# Altium schematic sheet FPGA_MGT.SchDoc: AMC FMC Carrier v4
size A2; CompanyName: WUT; Address1: Warsaw Univeristy of Technology; Address2: Nowowiejska 15/19 00-665 Warsaw; Address3: t.przywozki@gmail.com; DocumentNumber: 1; Revision: 1; SheetNumber: 5; SheetTotal: 29; ModifiedBy: -; CheckedDate: -; Title2: FPGA GTP banks; DivGrp: ISE; Designer: T.Przywozki; Project: AMC FMC Carrier v4
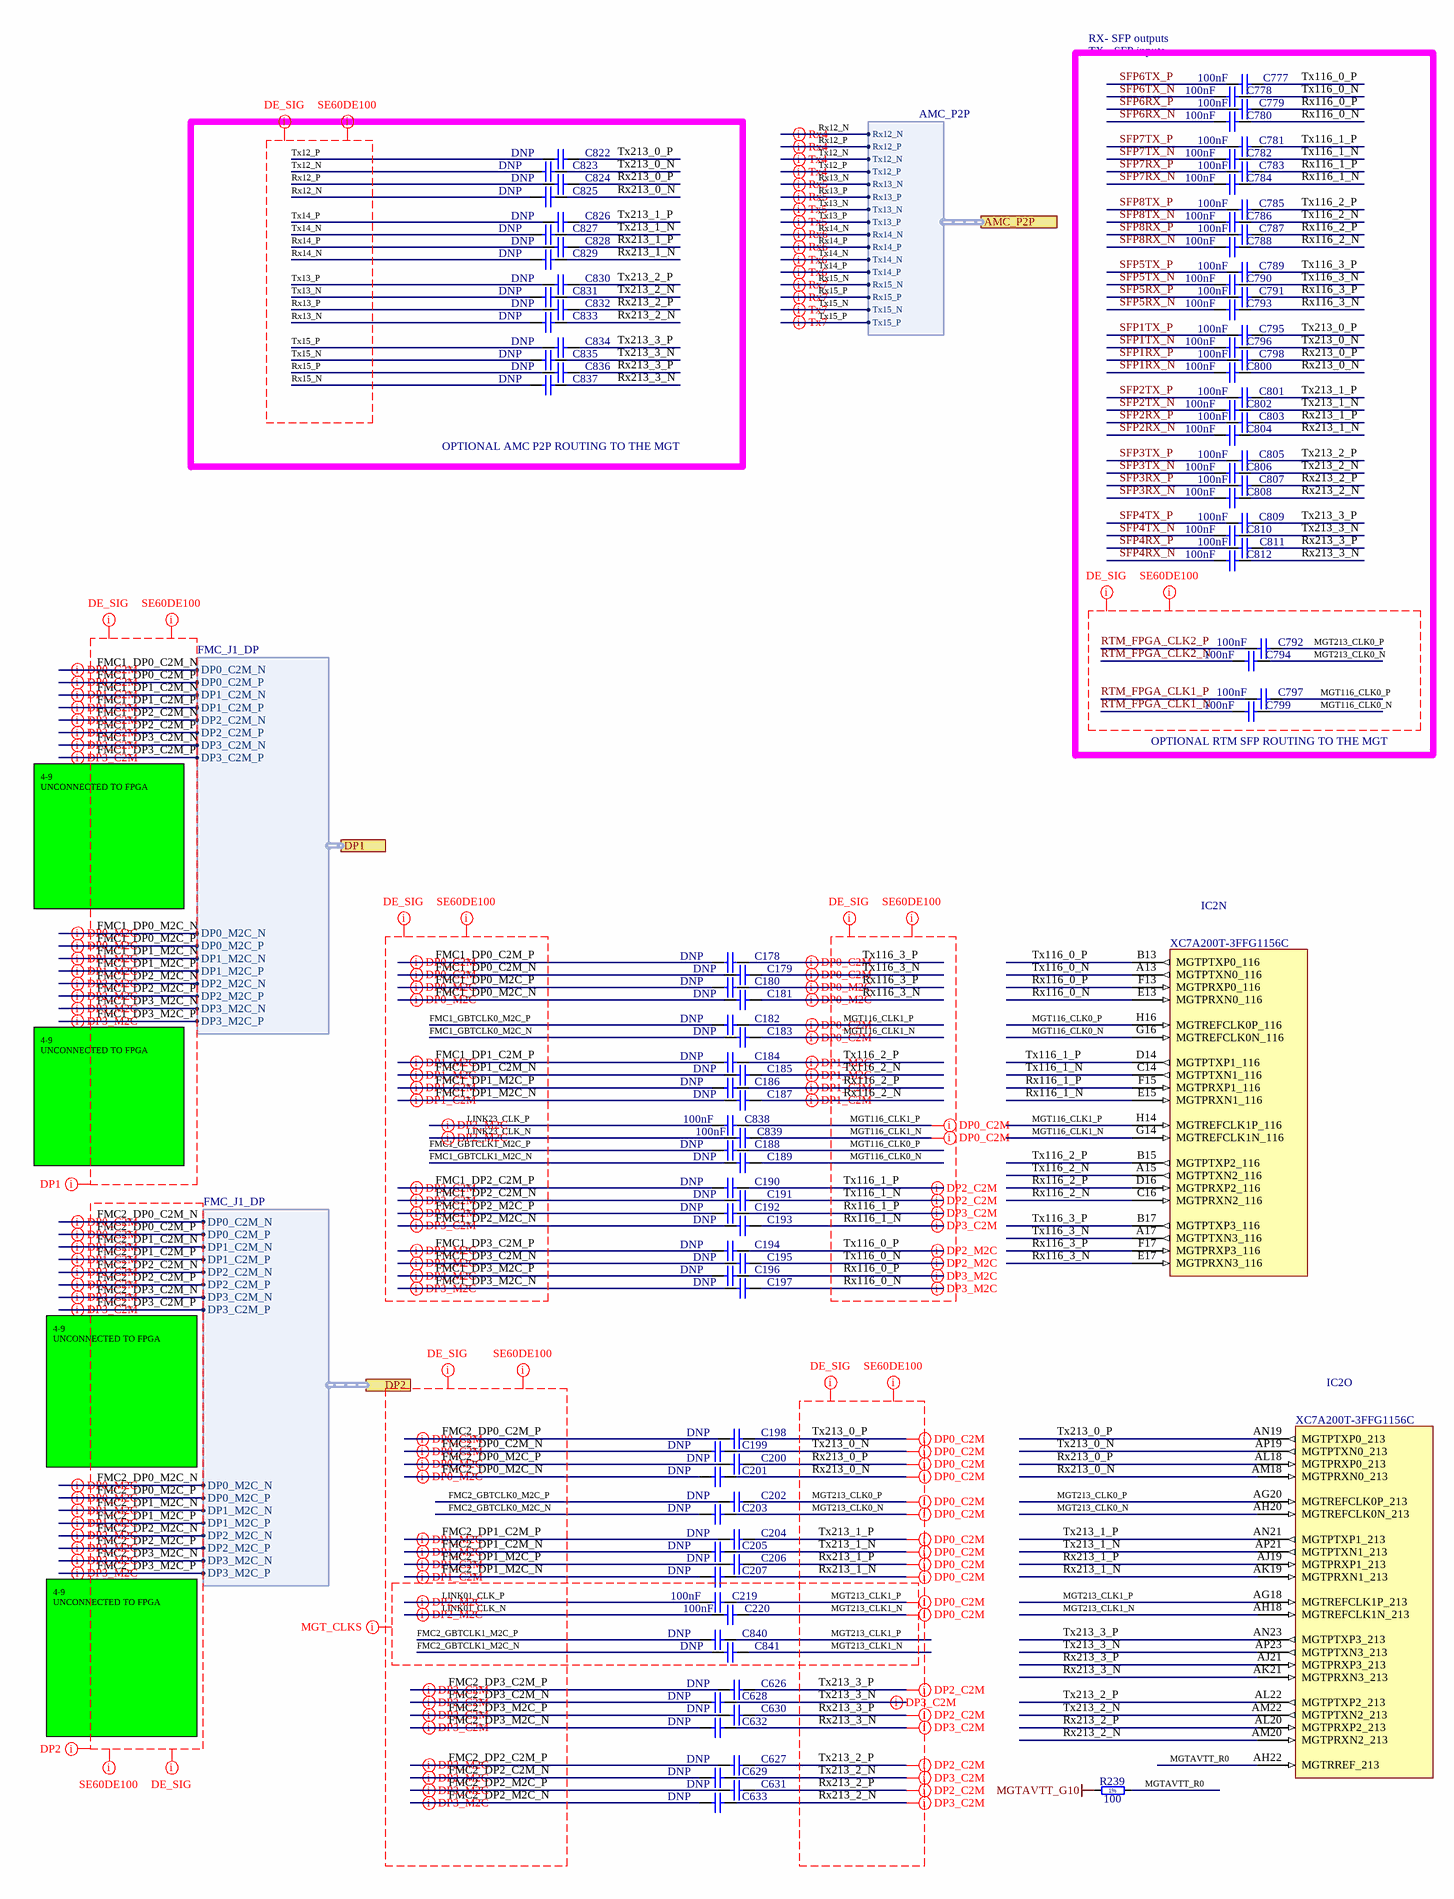
[diagram p0: FPGA_MGT.SchDoc, left]
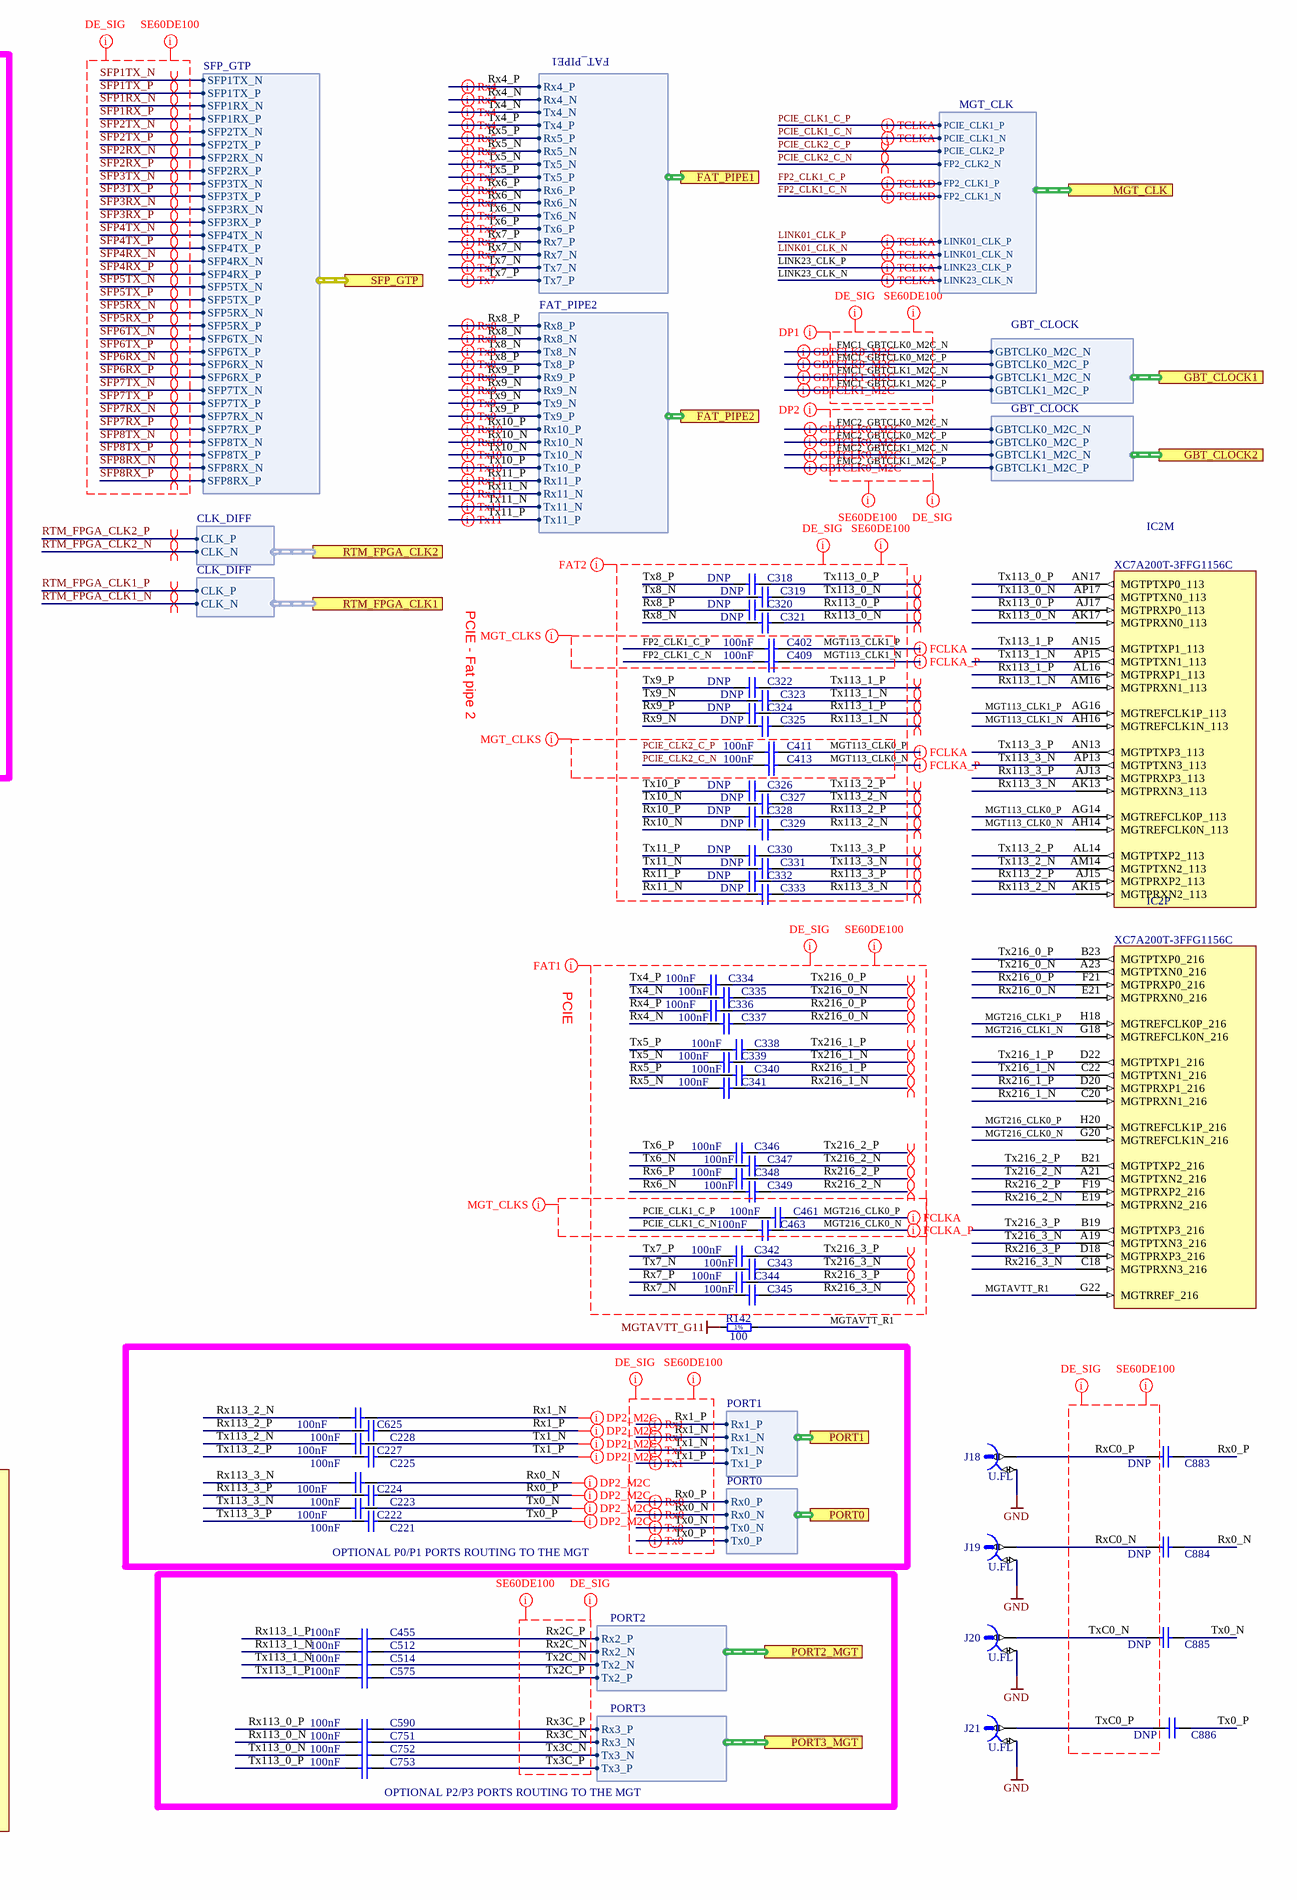
[diagram p1: FPGA_MGT.SchDoc, right]

## Parts
C178  DNP  [CAPC0603X33N]
C179  DNP  [CAPC0603X33N]
C180  DNP  [CAPC0603X33N]
C181  DNP  [CAPC0603X33N]
C182  DNP  [CAPC0603X33N]
C183  DNP  [CAPC0603X33N]
C184  DNP  [CAPC0603X33N]
C185  DNP  [CAPC0603X33N]
C186  DNP  [CAPC0603X33N]
C187  DNP  [CAPC0603X33N]
C188  DNP  [CAPC0603X33N]
C189  DNP  [CAPC0603X33N]
C190  DNP  [CAPC0603X33N]
C191  DNP  [CAPC0603X33N]
C192  DNP  [CAPC0603X33N]
C193  DNP  [CAPC0603X33N]
C194  DNP  [CAPC0603X33N]
C195  DNP  [CAPC0603X33N]
C196  DNP  [CAPC0603X33N]
C197  DNP  [CAPC0603X33N]
C198  DNP  [CAPC0603X33N]
C199  DNP  [CAPC0603X33N]
C200  DNP  [CAPC0603X33N]
C201  DNP  [CAPC0603X33N]
C202  DNP  [CAPC0603X33N]
C203  DNP  [CAPC0603X33N]
C204  DNP  [CAPC0603X33N]
C205  DNP  [CAPC0603X33N]
C206  DNP  [CAPC0603X33N]
C207  DNP  [CAPC0603X33N]
C219  100nF  [CAPC0603X33N]
C220  100nF  [CAPC0603X33N]
C221  100nF  [CAPC0603X33N]
C222  100nF  [CAPC0603X33N]
C223  100nF  [CAPC0603X33N]
C224  100nF  [CAPC0603X33N]
C225  100nF  [CAPC0603X33N]
C227  100nF  [CAPC0603X33N]
C228  100nF  [CAPC0603X33N]
C318  DNP  [CAPC0603X33N]
C319  DNP  [CAPC0603X33N]
C320  DNP  [CAPC0603X33N]
C321  DNP  [CAPC0603X33N]
C322  DNP  [CAPC0603X33N]
C323  DNP  [CAPC0603X33N]
C324  DNP  [CAPC0603X33N]
C325  DNP  [CAPC0603X33N]
C326  DNP  [CAPC0603X33N]
C327  DNP  [CAPC0603X33N]
C328  DNP  [CAPC0603X33N]
C329  DNP  [CAPC0603X33N]
C330  DNP  [CAPC0603X33N]
C331  DNP  [CAPC0603X33N]
C332  DNP  [CAPC0603X33N]
C333  DNP  [CAPC0603X33N]
C334  100nF  [CAPC0603X33N]
C335  100nF  [CAPC0603X33N]
C336  100nF  [CAPC0603X33N]
C337  100nF  [CAPC0603X33N]
C338  100nF  [CAPC0603X33N]
C339  100nF  [CAPC0603X33N]
C340  100nF  [CAPC0603X33N]
C341  100nF  [CAPC0603X33N]
C342  100nF  [CAPC0603X33N]
C343  100nF  [CAPC0603X33N]
C344  100nF  [CAPC0603X33N]
C345  100nF  [CAPC0603X33N]
C346  100nF  [CAPC0603X33N]
C347  100nF  [CAPC0603X33N]
C348  100nF  [CAPC0603X33N]
C349  100nF  [CAPC0603X33N]
C402  100nF  [CAPC0603X33N]
C409  100nF  [CAPC0603X33N]
C411  100nF  [CAPC0603X33N]
C413  100nF  [CAPC0603X33N]
C455  100nF  [CAPC0603X33N]
C461  100nF  [CAPC0603X33N]
C463  100nF  [CAPC0603X33N]
C512  100nF  [CAPC0603X33N]
C514  100nF  [CAPC0603X33N]
C575  100nF  [CAPC0603X33N]
C590  100nF  [CAPC0603X33N]
C625  100nF  [CAPC0603X33N]
C626  DNP  [CAPC0603X33N]
C627  DNP  [CAPC0603X33N]
C628  DNP  [CAPC0603X33N]
C629  DNP  [CAPC0603X33N]
C630  DNP  [CAPC0603X33N]
C631  DNP  [CAPC0603X33N]
C632  DNP  [CAPC0603X33N]
C633  DNP  [CAPC0603X33N]
C751  100nF  [CAPC0603X33N]
C752  100nF  [CAPC0603X33N]
C753  100nF  [CAPC0603X33N]
C777  100nF  [CAPC0603X33N]
C778  100nF  [CAPC0603X33N]
C779  100nF  [CAPC0603X33N]
C780  100nF  [CAPC0603X33N]
C781  100nF  [CAPC0603X33N]
C782  100nF  [CAPC0603X33N]
C783  100nF  [CAPC0603X33N]
C784  100nF  [CAPC0603X33N]
C785  100nF  [CAPC0603X33N]
C786  100nF  [CAPC0603X33N]
C787  100nF  [CAPC0603X33N]
C788  100nF  [CAPC0603X33N]
C789  100nF  [CAPC0603X33N]
C790  100nF  [CAPC0603X33N]
C791  100nF  [CAPC0603X33N]
C792  100nF  [CAPC0603X33N]
C793  100nF  [CAPC0603X33N]
C794  100nF  [CAPC0603X33N]
C795  100nF  [CAPC0603X33N]
C796  100nF  [CAPC0603X33N]
C797  100nF  [CAPC0603X33N]
C798  100nF  [CAPC0603X33N]
C799  100nF  [CAPC0603X33N]
C800  100nF  [CAPC0603X33N]
C801  100nF  [CAPC0603X33N]
C802  100nF  [CAPC0603X33N]
C803  100nF  [CAPC0603X33N]
C804  100nF  [CAPC0603X33N]
C805  100nF  [CAPC0603X33N]
C806  100nF  [CAPC0603X33N]
C807  100nF  [CAPC0603X33N]
C808  100nF  [CAPC0603X33N]
C809  100nF  [CAPC0603X33N]
C810  100nF  [CAPC0603X33N]
C811  100nF  [CAPC0603X33N]
C812  100nF  [CAPC0603X33N]
C822  DNP  [CAPC0603X33N]
C823  DNP  [CAPC0603X33N]
C824  DNP  [CAPC0603X33N]
C825  DNP  [CAPC0603X33N]
C826  DNP  [CAPC0603X33N]
C827  DNP  [CAPC0603X33N]
C828  DNP  [CAPC0603X33N]
C829  DNP  [CAPC0603X33N]
C830  DNP  [CAPC0603X33N]
C831  DNP  [CAPC0603X33N]
C832  DNP  [CAPC0603X33N]
C833  DNP  [CAPC0603X33N]
C834  DNP  [CAPC0603X33N]
C835  DNP  [CAPC0603X33N]
C836  DNP  [CAPC0603X33N]
C837  DNP  [CAPC0603X33N]
C838  100nF  [CAPC0603X33N]
C839  100nF  [CAPC0603X33N]
C840  DNP  [CAPC0603X33N]
C841  DNP  [CAPC0603X33N]
C883  DNP  [CAPC0603X33N]
C884  DNP  [CAPC0603X33N]
C885  DNP  [CAPC0603X33N]
C886  DNP  [CAPC0603X33N]
IC2  XC7A200T-3FFG1156C  [BGA1156C100P34X34_3500X3500X335]  (parts M,N,O,P of 23)
J18  U.FL  [HIROSE_U.FL-R-SMT-1(10)]
J19  U.FL  [HIROSE_U.FL-R-SMT-1(10)]
J20  U.FL  [HIROSE_U.FL-R-SMT-1(10)]
J21  U.FL  [HIROSE_U.FL-R-SMT-1(10)]
R142  100  [RESC1005X40N]
R239  100  [RESC1005X40N]

## Blocks framed on the sheet
OPTIONAL AMC P2P ROUTING TO THE MGT: C822-C837
OPTIONAL P0/P1 PORTS ROUTING TO THE MGT: C221-C225 C227 C228 C625

## Ports
AMC_P2P (harness AMC_P2P), DP1 (harness FMC_J1_DP), DP2 (harness FMC_J1_DP), FAT_PIPE1 (harness FAT_PIPE1), FAT_PIPE2 (harness FAT_PIPE2), GBT_CLOCK1 (harness GBT_CLOCK), GBT_CLOCK2 (harness GBT_CLOCK), MGT_CLK (harness MGT_CLK), PORT0 (harness PORT0), PORT1 (harness PORT1), PORT2_MGT (harness PORT2), PORT3_MGT (harness PORT3), RTM_FPGA_CLK1 (harness CLK_DIFF), RTM_FPGA_CLK2 (harness CLK_DIFF), SFP_GTP (harness SFP_GTP)

## Harnesses
PORT0: Rx0_P, Rx0_N, Tx0_N, Tx0_P
PORT1: Rx1_P, Rx1_N, Tx1_N, Tx1_P
FAT_PIPE1: Rx4_P, Rx4_N, Tx4_N, Tx4_P, Rx5_P, Rx5_N, Tx5_N, Tx5_P, Rx6_P, Rx6_N, Tx6_N, Tx6_P, Rx7_P, Rx7_N, Tx7_N, Tx7_P
FAT_PIPE2: Rx8_P, Rx8_N, Tx8_N, Tx8_P, Rx9_P, Rx9_N, Tx9_N, Tx9_P, Rx10_P, Rx10_N, Tx10_N, Tx10_P, Rx11_P, Rx11_N, Tx11_N, Tx11_P
GBT_CLOCK: GBTCLK0_M2C_N, GBTCLK0_M2C_P, GBTCLK1_M2C_N, GBTCLK1_M2C_P
FMC_J1_DP: DP1_C2M_N, DP1_C2M_P, DP1_M2C_N, DP1_M2C_P, DP2_C2M_N, DP2_C2M_P, DP2_M2C_N, DP2_M2C_P, DP3_C2M_N, DP3_C2M_P, DP3_M2C_N, DP3_M2C_P, DP0_C2M_N, DP0_C2M_P, DP0_M2C_N, DP0_M2C_P
PORT3: Rx3_P, Rx3_N, Tx3_N, Tx3_P
PORT2: Rx2_P, Rx2_N, Tx2_N, Tx2_P
SFP_GTP: SFP1RX_N, SFP1RX_P, SFP1TX_N, SFP1TX_P, SFP2TX_N, SFP2TX_P, SFP2RX_N, SFP2RX_P, SFP3TX_N, SFP3TX_P, SFP3RX_N, SFP3RX_P, SFP4TX_N, SFP4TX_P, SFP4RX_N, SFP4RX_P, SFP5TX_N, SFP5TX_P, SFP5RX_N, SFP5RX_P, SFP6TX_N, SFP6TX_P, SFP6RX_N, SFP6RX_P, SFP7TX_N, SFP7TX_P, SFP7RX_N, SFP7RX_P, SFP8TX_N, SFP8TX_P, SFP8RX_N, SFP8RX_P
CLK_DIFF: CLK_P, CLK_N
AMC_P2P: Rx12_N, Rx12_P, Tx12_N, Tx12_P, Rx13_N, Rx13_P, Tx13_N, Tx13_P, Rx14_N, Rx14_P, Tx14_N, Tx14_P, Rx15_N, Rx15_P, Tx15_N, Tx15_P
MGT_CLK: PCIE_CLK1_P, PCIE_CLK1_N, FP2_CLK1_P, FP2_CLK1_N, PCIE_CLK2_P, FP2_CLK2_N, LINK01_CLK_P, LINK01_CLK_N, LINK23_CLK_P, LINK23_CLK_N

## Nets
GND: J18.2 J19.2 J20.2 J21.2
MGTAVTT_G10: R239.1
MGTAVTT_G11: R142.1
FMC1_DP0_C2M_N: C179.1 ; port DP1.DP0_C2M_N
FMC1_DP0_C2M_P: C178.1 ; port DP1.DP0_C2M_P
FMC1_DP0_M2C_N: C181.1 ; port DP1.DP0_M2C_N
FMC1_DP0_M2C_P: C180.1 ; port DP1.DP0_M2C_P
FMC1_DP1_C2M_N: C185.1 ; port DP1.DP1_C2M_N
FMC1_DP1_C2M_P: C184.1 ; port DP1.DP1_C2M_P
FMC1_DP1_M2C_N: C187.1 ; port DP1.DP1_M2C_N
FMC1_DP1_M2C_P: C186.1 ; port DP1.DP1_M2C_P
FMC1_DP2_C2M_N: C191.1 ; port DP1.DP2_C2M_N
FMC1_DP2_C2M_P: C190.1 ; port DP1.DP2_C2M_P
FMC1_DP2_M2C_N: C193.1 ; port DP1.DP2_M2C_N
FMC1_DP2_M2C_P: C192.1 ; port DP1.DP2_M2C_P
FMC1_DP3_C2M_N: C195.1 ; port DP1.DP3_C2M_N
FMC1_DP3_C2M_P: C194.1 ; port DP1.DP3_C2M_P
FMC1_DP3_M2C_N: C197.1 ; port DP1.DP3_M2C_N
FMC1_DP3_M2C_P: C196.1 ; port DP1.DP3_M2C_P
FMC1_GBTCLK0_M2C_N: C183.1 ; port GBT_CLOCK1.GBTCLK0_M2C_N
FMC1_GBTCLK0_M2C_P: C182.1 ; port GBT_CLOCK1.GBTCLK0_M2C_P
FMC1_GBTCLK1_M2C_N: C189.1 ; port GBT_CLOCK1.GBTCLK1_M2C_N
FMC1_GBTCLK1_M2C_P: C188.1 ; port GBT_CLOCK1.GBTCLK1_M2C_P
FMC2_DP0_C2M_N: C199.1 ; port DP2.DP0_C2M_N
FMC2_DP0_C2M_P: C198.1 ; port DP2.DP0_C2M_P
FMC2_DP0_M2C_N: C201.1 ; port DP2.DP0_M2C_N
FMC2_DP0_M2C_P: C200.1 ; port DP2.DP0_M2C_P
FMC2_DP1_C2M_N: C205.1 ; port DP2.DP1_C2M_N
FMC2_DP1_C2M_P: C204.1 ; port DP2.DP1_C2M_P
FMC2_DP1_M2C_N: C207.1 ; port DP2.DP1_M2C_N
FMC2_DP1_M2C_P: C206.1 ; port DP2.DP1_M2C_P
FMC2_DP2_C2M_N: C629.1 ; port DP2.DP2_C2M_N
FMC2_DP2_C2M_P: C627.1 ; port DP2.DP2_C2M_P
FMC2_DP2_M2C_N: C633.1 ; port DP2.DP2_M2C_N
FMC2_DP2_M2C_P: C631.1 ; port DP2.DP2_M2C_P
FMC2_DP3_C2M_N: C628.1 ; port DP2.DP3_C2M_N
FMC2_DP3_C2M_P: C626.1 ; port DP2.DP3_C2M_P
FMC2_DP3_M2C_N: C632.1 ; port DP2.DP3_M2C_N
FMC2_DP3_M2C_P: C630.1 ; port DP2.DP3_M2C_P
FMC2_GBTCLK0_M2C_N: C203.1 ; port GBT_CLOCK2.GBTCLK0_M2C_N
FMC2_GBTCLK0_M2C_P: C202.1 ; port GBT_CLOCK2.GBTCLK0_M2C_P
FMC2_GBTCLK1_M2C_N: C841.1 ; port GBT_CLOCK2.GBTCLK1_M2C_N
FMC2_GBTCLK1_M2C_P: C840.1 ; port GBT_CLOCK2.GBTCLK1_M2C_P
FP2_CLK1_C_N: C409.1 ; port MGT_CLK.FP2_CLK1_N
FP2_CLK1_C_P: C402.1 ; port MGT_CLK.FP2_CLK1_P
LINK01_CLK_N: C220.1 ; port MGT_CLK.LINK01_CLK_N
LINK01_CLK_P: C219.1 ; port MGT_CLK.LINK01_CLK_P
LINK23_CLK_N: C839.1 ; port MGT_CLK.LINK23_CLK_N
LINK23_CLK_P: C838.1 ; port MGT_CLK.LINK23_CLK_P
MGT113_CLK0_N: C413.2 IC2.AH14(MGTREFCLK0N_113)
MGT113_CLK0_P: C411.2 IC2.AG14(MGTREFCLK0P_113)
MGT113_CLK1_N: C409.2 IC2.AH16(MGTREFCLK1N_113)
MGT113_CLK1_P: C402.2 IC2.AG16(MGTREFCLK1P_113)
MGT116_CLK0_N: C189.2 C799.2 IC2.G16(MGTREFCLK0N_116)
MGT116_CLK0_P: C188.2 C797.2 IC2.H16(MGTREFCLK0P_116)
MGT116_CLK1_N: C183.2 C839.2 IC2.G14(MGTREFCLK1N_116)
MGT116_CLK1_P: C182.2 C838.2 IC2.H14(MGTREFCLK1P_116)
MGT213_CLK0_N: C203.2 C794.2 IC2.AH20(MGTREFCLK0N_213)
MGT213_CLK0_P: C202.2 C792.2 IC2.AG20(MGTREFCLK0P_213)
MGT213_CLK1_N: C220.2 C841.2 IC2.AH18(MGTREFCLK1N_213)
MGT213_CLK1_P: C219.2 C840.2 IC2.AG18(MGTREFCLK1P_213)
MGT216_CLK0_N: C463.2 IC2.G20(MGTREFCLK1N_216)
MGT216_CLK0_P: C461.2 IC2.H20(MGTREFCLK1P_216)
MGT216_CLK1_N: IC2.G18(MGTREFCLK0N_216)
MGT216_CLK1_P: IC2.H18(MGTREFCLK0P_216)
MGTAVTT_R0: IC2.AH22(MGTRREF_213) R239.2
MGTAVTT_R1: IC2.G22(MGTRREF_216) R142.2
PCIE_CLK1_C_N: C463.1 ; port MGT_CLK.PCIE_CLK1_N
PCIE_CLK1_C_P: C461.1 ; port MGT_CLK.PCIE_CLK1_P
PCIE_CLK2_C_N: C413.1 ; port MGT_CLK.FP2_CLK2_N
PCIE_CLK2_C_P: C411.1 ; port MGT_CLK.PCIE_CLK2_P
RTM_FPGA_CLK1_N: C799.1 ; port RTM_FPGA_CLK1.CLK_N
RTM_FPGA_CLK1_P: C797.1 ; port RTM_FPGA_CLK1.CLK_P
RTM_FPGA_CLK2_N: C794.1 ; port RTM_FPGA_CLK2.CLK_N
RTM_FPGA_CLK2_P: C792.1 ; port RTM_FPGA_CLK2.CLK_P
Rx0_N: C224.1 C884.1 ; port PORT0.Rx0_N
Rx0_P: C223.1 C883.1 ; port PORT0.Rx0_P
Rx1_N: C625.1 ; port PORT1.Rx1_N
Rx1_P: C228.1 ; port PORT1.Rx1_P
Rx2C_N: C512.2 ; port PORT2_MGT.Rx2_N
Rx2C_P: C455.2 ; port PORT2_MGT.Rx2_P
Rx3C_N: C751.2 ; port PORT3_MGT.Rx3_N
Rx3C_P: C590.2 ; port PORT3_MGT.Rx3_P
Rx4_N: C337.1 ; port FAT_PIPE1.Rx4_N
Rx4_P: C336.1 ; port FAT_PIPE1.Rx4_P
Rx5_N: C341.1 ; port FAT_PIPE1.Rx5_N
Rx5_P: C340.1 ; port FAT_PIPE1.Rx5_P
Rx6_N: C349.1 ; port FAT_PIPE1.Rx6_N
Rx6_P: C348.1 ; port FAT_PIPE1.Rx6_P
Rx7_N: C345.1 ; port FAT_PIPE1.Rx7_N
Rx7_P: C344.1 ; port FAT_PIPE1.Rx7_P
Rx8_N: C321.1 ; port FAT_PIPE2.Rx8_N
Rx8_P: C320.1 ; port FAT_PIPE2.Rx8_P
Rx9_N: C325.1 ; port FAT_PIPE2.Rx9_N
Rx9_P: C324.1 ; port FAT_PIPE2.Rx9_P
Rx10_N: C329.1 ; port FAT_PIPE2.Rx10_N
Rx10_P: C328.1 ; port FAT_PIPE2.Rx10_P
Rx11_N: C333.1 ; port FAT_PIPE2.Rx11_N
Rx11_P: C332.1 ; port FAT_PIPE2.Rx11_P
Rx12_N: C825.1 ; port AMC_P2P.Rx12_N
Rx12_P: C824.1 ; port AMC_P2P.Rx12_P
Rx13_N: C833.1 ; port AMC_P2P.Rx13_N
Rx13_P: C832.1 ; port AMC_P2P.Rx13_P
Rx14_N: C829.1 ; port AMC_P2P.Rx14_N
Rx14_P: C828.1 ; port AMC_P2P.Rx14_P
Rx15_N: C837.1 ; port AMC_P2P.Rx15_N
Rx15_P: C836.1 ; port AMC_P2P.Rx15_P
Rx113_0_N: C321.2 C751.1 IC2.AK17(MGTPRXN0_113)
Rx113_0_P: C320.2 C590.1 IC2.AJ17(MGTPRXP0_113)
Rx113_1_N: C325.2 C512.1 IC2.AM16(MGTPRXN1_113)
Rx113_1_P: C324.2 C455.1 IC2.AL16(MGTPRXP1_113)
Rx113_2_N: C329.2 C625.2 IC2.AK15(MGTPRXN2_113)
Rx113_2_P: C228.2 C328.2 IC2.AJ15(MGTPRXP2_113)
Rx113_3_N: C224.2 C333.2 IC2.AK13(MGTPRXN3_113)
Rx113_3_P: C223.2 C332.2 IC2.AJ13(MGTPRXP3_113)
Rx116_0_N: C197.2 C780.2 IC2.E13(MGTPRXN0_116)
Rx116_0_P: C196.2 C779.2 IC2.F13(MGTPRXP0_116)
Rx116_1_N: C193.2 C784.2 IC2.E15(MGTPRXN1_116)
Rx116_1_P: C192.2 C783.2 IC2.F15(MGTPRXP1_116)
Rx116_2_N: C187.2 C788.2 IC2.C16(MGTPRXN2_116)
Rx116_2_P: C186.2 C787.2 IC2.D16(MGTPRXP2_116)
Rx116_3_N: C181.2 C793.2 IC2.E17(MGTPRXN3_116)
Rx116_3_P: C180.2 C791.2 IC2.F17(MGTPRXP3_116)
Rx213_0_N: C201.2 C800.2 C825.2 IC2.AM18(MGTPRXN0_213)
Rx213_0_P: C200.2 C798.2 C824.2 IC2.AL18(MGTPRXP0_213)
Rx213_1_N: C207.2 C804.2 C829.2 IC2.AK19(MGTPRXN1_213)
Rx213_1_P: C206.2 C803.2 C828.2 IC2.AJ19(MGTPRXP1_213)
Rx213_2_N: C633.2 C808.2 C833.2 IC2.AM20(MGTPRXN2_213)
Rx213_2_P: C631.2 C807.2 C832.2 IC2.AL20(MGTPRXP2_213)
Rx213_3_N: C632.2 C812.2 C837.2 IC2.AK21(MGTPRXN3_213)
Rx213_3_P: C630.2 C811.2 C836.2 IC2.AJ21(MGTPRXP3_213)
Rx216_0_N: C337.2 IC2.E21(MGTPRXN0_216)
Rx216_0_P: C336.2 IC2.F21(MGTPRXP0_216)
Rx216_1_N: C341.2 IC2.C20(MGTPRXN1_216)
Rx216_1_P: C340.2 IC2.D20(MGTPRXP1_216)
Rx216_2_N: C349.2 IC2.E19(MGTPRXN2_216)
Rx216_2_P: C348.2 IC2.F19(MGTPRXP2_216)
Rx216_3_N: C345.2 IC2.C18(MGTPRXN3_216)
Rx216_3_P: C344.2 IC2.D18(MGTPRXP3_216)
RxC0_N: C884.2 J19.1
RxC0_P: C883.2 J18.1
SFP1RX_N: C800.1 ; port SFP_GTP.SFP1RX_N
SFP1RX_P: C798.1 ; port SFP_GTP.SFP1RX_P
SFP1TX_N: C796.1 ; port SFP_GTP.SFP1TX_N
SFP1TX_P: C795.1 ; port SFP_GTP.SFP1TX_P
SFP2RX_N: C804.1 ; port SFP_GTP.SFP2RX_N
SFP2RX_P: C803.1 ; port SFP_GTP.SFP2RX_P
SFP2TX_N: C802.1 ; port SFP_GTP.SFP2TX_N
SFP2TX_P: C801.1 ; port SFP_GTP.SFP2TX_P
SFP3RX_N: C808.1 ; port SFP_GTP.SFP3RX_N
SFP3RX_P: C807.1 ; port SFP_GTP.SFP3RX_P
SFP3TX_N: C806.1 ; port SFP_GTP.SFP3TX_N
SFP3TX_P: C805.1 ; port SFP_GTP.SFP3TX_P
SFP4RX_N: C812.1 ; port SFP_GTP.SFP4RX_N
SFP4RX_P: C811.1 ; port SFP_GTP.SFP4RX_P
SFP4TX_N: C810.1 ; port SFP_GTP.SFP4TX_N
SFP4TX_P: C809.1 ; port SFP_GTP.SFP4TX_P
SFP5RX_N: C793.1 ; port SFP_GTP.SFP5RX_N
SFP5RX_P: C791.1 ; port SFP_GTP.SFP5RX_P
SFP5TX_N: C790.1 ; port SFP_GTP.SFP5TX_N
SFP5TX_P: C789.1 ; port SFP_GTP.SFP5TX_P
SFP6RX_N: C780.1 ; port SFP_GTP.SFP6RX_N
SFP6RX_P: C779.1 ; port SFP_GTP.SFP6RX_P
SFP6TX_N: C778.1 ; port SFP_GTP.SFP6TX_N
SFP6TX_P: C777.1 ; port SFP_GTP.SFP6TX_P
SFP7RX_N: C784.1 ; port SFP_GTP.SFP7RX_N
SFP7RX_P: C783.1 ; port SFP_GTP.SFP7RX_P
SFP7TX_N: C782.1 ; port SFP_GTP.SFP7TX_N
SFP7TX_P: C781.1 ; port SFP_GTP.SFP7TX_P
SFP8RX_N: C788.1 ; port SFP_GTP.SFP8RX_N
SFP8RX_P: C787.1 ; port SFP_GTP.SFP8RX_P
SFP8TX_N: C786.1 ; port SFP_GTP.SFP8TX_N
SFP8TX_P: C785.1 ; port SFP_GTP.SFP8TX_P
Tx0_N: C222.1 C885.1 ; port PORT0.Tx0_N
Tx0_P: C221.1 C886.1 ; port PORT0.Tx0_P
Tx1_N: C227.1 ; port PORT1.Tx1_N
Tx1_P: C225.1 ; port PORT1.Tx1_P
Tx2C_N: C514.2 ; port PORT2_MGT.Tx2_N
Tx2C_P: C575.2 ; port PORT2_MGT.Tx2_P
Tx3C_N: C752.2 ; port PORT3_MGT.Tx3_N
Tx3C_P: C753.2 ; port PORT3_MGT.Tx3_P
Tx4_N: C335.1 ; port FAT_PIPE1.Tx4_N
Tx4_P: C334.1 ; port FAT_PIPE1.Tx4_P
Tx5_N: C339.1 ; port FAT_PIPE1.Tx5_N
Tx5_P: C338.1 ; port FAT_PIPE1.Tx5_P
Tx6_N: C347.1 ; port FAT_PIPE1.Tx6_N
Tx6_P: C346.1 ; port FAT_PIPE1.Tx6_P
Tx7_N: C343.1 ; port FAT_PIPE1.Tx7_N
Tx7_P: C342.1 ; port FAT_PIPE1.Tx7_P
Tx8_N: C319.1 ; port FAT_PIPE2.Tx8_N
Tx8_P: C318.1 ; port FAT_PIPE2.Tx8_P
Tx9_N: C323.1 ; port FAT_PIPE2.Tx9_N
Tx9_P: C322.1 ; port FAT_PIPE2.Tx9_P
Tx10_N: C327.1 ; port FAT_PIPE2.Tx10_N
Tx10_P: C326.1 ; port FAT_PIPE2.Tx10_P
Tx11_N: C331.1 ; port FAT_PIPE2.Tx11_N
Tx11_P: C330.1 ; port FAT_PIPE2.Tx11_P
Tx12_N: C823.1 ; port AMC_P2P.Tx12_N
Tx12_P: C822.1 ; port AMC_P2P.Tx12_P
Tx13_N: C831.1 ; port AMC_P2P.Tx13_N
Tx13_P: C830.1 ; port AMC_P2P.Tx13_P
Tx14_N: C827.1 ; port AMC_P2P.Tx14_N
Tx14_P: C826.1 ; port AMC_P2P.Tx14_P
Tx15_N: C835.1 ; port AMC_P2P.Tx15_N
Tx15_P: C834.1 ; port AMC_P2P.Tx15_P
Tx113_0_N: C319.2 C752.1 IC2.AP17(MGTPTXN0_113)
Tx113_0_P: C318.2 C753.1 IC2.AN17(MGTPTXP0_113)
Tx113_1_N: C323.2 C514.1 IC2.AP15(MGTPTXN1_113)
Tx113_1_P: C322.2 C575.1 IC2.AN15(MGTPTXP1_113)
Tx113_2_N: C227.2 C327.2 IC2.AM14(MGTPTXN2_113)
Tx113_2_P: C225.2 C326.2 IC2.AL14(MGTPTXP2_113)
Tx113_3_N: C222.2 C331.2 IC2.AP13(MGTPTXN3_113)
Tx113_3_P: C221.2 C330.2 IC2.AN13(MGTPTXP3_113)
Tx116_0_N: C195.2 C778.2 IC2.A13(MGTPTXN0_116)
Tx116_0_P: C194.2 C777.2 IC2.B13(MGTPTXP0_116)
Tx116_1_N: C191.2 C782.2 IC2.C14(MGTPTXN1_116)
Tx116_1_P: C190.2 C781.2 IC2.D14(MGTPTXP1_116)
Tx116_2_N: C185.2 C786.2 IC2.A15(MGTPTXN2_116)
Tx116_2_P: C184.2 C785.2 IC2.B15(MGTPTXP2_116)
Tx116_3_N: C179.2 C790.2 IC2.A17(MGTPTXN3_116)
Tx116_3_P: C178.2 C789.2 IC2.B17(MGTPTXP3_116)
Tx213_0_N: C199.2 C796.2 C823.2 IC2.AP19(MGTPTXN0_213)
Tx213_0_P: C198.2 C795.2 C822.2 IC2.AN19(MGTPTXP0_213)
Tx213_1_N: C205.2 C802.2 C827.2 IC2.AP21(MGTPTXN1_213)
Tx213_1_P: C204.2 C801.2 C826.2 IC2.AN21(MGTPTXP1_213)
Tx213_2_N: C629.2 C806.2 C831.2 IC2.AM22(MGTPTXN2_213)
Tx213_2_P: C627.2 C805.2 C830.2 IC2.AL22(MGTPTXP2_213)
Tx213_3_N: C628.2 C810.2 C835.2 IC2.AP23(MGTPTXN3_213)
Tx213_3_P: C626.2 C809.2 C834.2 IC2.AN23(MGTPTXP3_213)
Tx216_0_N: C335.2 IC2.A23(MGTPTXN0_216)
Tx216_0_P: C334.2 IC2.B23(MGTPTXP0_216)
Tx216_1_N: C339.2 IC2.C22(MGTPTXN1_216)
Tx216_1_P: C338.2 IC2.D22(MGTPTXP1_216)
Tx216_2_N: C347.2 IC2.A21(MGTPTXN2_216)
Tx216_2_P: C346.2 IC2.B21(MGTPTXP2_216)
Tx216_3_N: C343.2 IC2.A19(MGTPTXN3_216)
Tx216_3_P: C342.2 IC2.B19(MGTPTXP3_216)
TxC0_N: C885.2 J20.1
TxC0_P: C886.2 J21.1

## Layout directives
differential pair: FMC1_DP0_C2M_N, FMC1_DP0_C2M_P, FMC1_DP0_M2C_N, FMC1_DP0_M2C_P, FMC1_DP1_C2M_N, FMC1_DP1_C2M_P, FMC1_DP1_M2C_N, FMC1_DP1_M2C_P, FMC1_DP2_C2M_N, FMC1_DP2_C2M_P, FMC1_DP2_M2C_N, FMC1_DP2_M2C_P, FMC1_DP3_C2M_N, FMC1_DP3_C2M_P, FMC1_DP3_M2C_N, FMC1_DP3_M2C_P, FMC1_GBTCLK0_M2C_N, FMC1_GBTCLK0_M2C_P, FMC1_GBTCLK1_M2C_N, FMC1_GBTCLK1_M2C_P, FMC2_DP0_C2M_N, FMC2_DP0_C2M_P, FMC2_DP0_M2C_N, FMC2_DP0_M2C_P, FMC2_DP1_C2M_N, FMC2_DP1_C2M_P, FMC2_DP1_M2C_N, FMC2_DP1_M2C_P, FMC2_DP2_C2M_N, FMC2_DP2_C2M_P, FMC2_DP2_M2C_N, FMC2_DP2_M2C_P, FMC2_DP3_C2M_N, FMC2_DP3_C2M_P, FMC2_DP3_M2C_N, FMC2_DP3_M2C_P, FMC2_GBTCLK0_M2C_N, FMC2_GBTCLK0_M2C_P, FMC2_GBTCLK1_M2C_N, FMC2_GBTCLK1_M2C_P, FP2_CLK1_C_N, FP2_CLK1_C_P, LINK01_CLK_N, LINK01_CLK_P, LINK23_CLK_N, LINK23_CLK_P, MGT113_CLK0_N, MGT113_CLK0_P, MGT113_CLK1_N, MGT113_CLK1_P, MGT116_CLK1_N, MGT116_CLK1_P, MGT213_CLK0_N, MGT213_CLK0_P, MGT213_CLK1_N, MGT213_CLK1_P, MGT216_CLK0_N, MGT216_CLK0_P, PCIE_CLK1_C_N, PCIE_CLK1_C_P, PCIE_CLK2_C_N, PCIE_CLK2_C_P, RTM_FPGA_CLK1_N, RTM_FPGA_CLK1_P, RTM_FPGA_CLK2_N, RTM_FPGA_CLK2_P, Rx0_N, Rx0_P, Rx1_N, Rx1_P, Rx4_N, Rx4_P, Rx5_N, Rx5_P, Rx6_N, Rx6_P, Rx7_N, Rx7_P, Rx8_N, Rx8_P, Rx9_N, Rx9_P, Rx10_N, Rx10_P, Rx11_N, Rx11_P, Rx12_N, Rx12_P, Rx13_N, Rx13_P, Rx14_N, Rx14_P, Rx15_N, Rx15_P, Rx113_0_N, Rx113_0_P, Rx113_1_N, Rx113_1_P, Rx113_2_N, Rx113_2_P, Rx113_3_N, Rx113_3_P, Rx116_0_N, Rx116_0_P, Rx116_1_N, Rx116_1_P, Rx116_2_N, Rx116_2_P, Rx116_3_N, Rx116_3_P, Rx213_0_N, Rx213_0_P, Rx213_1_N, Rx213_1_P, Rx213_2_N, Rx213_2_P, Rx213_3_N, Rx213_3_P, Rx216_0_N, Rx216_0_P, Rx216_1_N, Rx216_1_P, Rx216_2_N, Rx216_2_P, Rx216_3_N, Rx216_3_P, SFP1RX_N, SFP1RX_P, SFP1TX_N, SFP1TX_P, SFP2RX_N, SFP2RX_P, SFP2TX_N, SFP2TX_P, SFP3RX_N, SFP3RX_P, SFP3TX_N, SFP3TX_P, SFP4RX_N, SFP4RX_P, SFP4TX_N, SFP4TX_P, SFP5RX_N, SFP5RX_P, SFP5TX_N, SFP5TX_P, SFP6RX_N, SFP6RX_P, SFP6TX_N, SFP6TX_P, SFP7RX_N, SFP7RX_P, SFP7TX_N, SFP7TX_P, SFP8RX_N, SFP8RX_P, SFP8TX_N, SFP8TX_P, Tx0_N, Tx0_P, Tx1_N, Tx1_P, Tx4_N, Tx4_P, Tx5_N, Tx5_P, Tx6_N, Tx6_P, Tx7_N, Tx7_P, Tx8_N, Tx8_P, Tx9_N, Tx9_P, Tx10_N, Tx10_P, Tx11_N, Tx11_P, Tx12_N, Tx12_P, Tx13_N, Tx13_P, Tx14_N, Tx14_P, Tx15_N, Tx15_P, Tx113_0_N, Tx113_0_P, Tx113_1_N, Tx113_1_P, Tx113_2_N, Tx113_2_P, Tx113_3_N, Tx113_3_P, Tx116_0_N, Tx116_0_P, Tx116_1_N, Tx116_1_P, Tx116_2_N, Tx116_2_P, Tx116_3_N, Tx116_3_P, Tx213_0_N, Tx213_0_P, Tx213_1_N, Tx213_1_P, Tx213_2_N, Tx213_2_P, Tx213_3_N, Tx213_3_P, Tx216_0_N, Tx216_0_P, Tx216_1_N, Tx216_1_P, Tx216_2_N, Tx216_2_P, Tx216_3_N, Tx216_3_P
net class FAT2: FP2_CLK1_C_N, FP2_CLK1_C_P, MGT113_CLK0_N, MGT113_CLK0_P, MGT113_CLK1_N, MGT113_CLK1_P, PCIE_CLK2_C_N, PCIE_CLK2_C_P, Rx8_N, Rx8_P, Rx9_N, Rx9_P, Rx10_N, Rx10_P, Rx11_N, Rx11_P, Rx113_0_N, Rx113_0_P, Rx113_1_N, Rx113_1_P, Rx113_2_N, Rx113_2_P, Rx113_3_N, Rx113_3_P, Tx8_N, Tx8_P, Tx9_N, Tx9_P, Tx10_N, Tx10_P, Tx11_N, Tx11_P, Tx113_0_N, Tx113_0_P, Tx113_1_N, Tx113_1_P, Tx113_2_N, Tx113_2_P, Tx113_3_N, Tx113_3_P
net class FAT1: MGT216_CLK0_N, MGT216_CLK0_P, PCIE_CLK1_C_N, PCIE_CLK1_C_P, Rx4_N, Rx4_P, Rx5_N, Rx5_P, Rx6_N, Rx6_P, Rx7_N, Rx7_P, Rx216_0_N, Rx216_0_P, Rx216_1_N, Rx216_1_P, Rx216_2_N, Rx216_2_P, Rx216_3_N, Rx216_3_P, Tx4_N, Tx4_P, Tx5_N, Tx5_P, Tx6_N, Tx6_P, Tx7_N, Tx7_P, Tx216_0_N, Tx216_0_P, Tx216_1_N, Tx216_1_P, Tx216_2_N, Tx216_2_P, Tx216_3_N, Tx216_3_P
net class DP2: FMC2_DP0_C2M_N, FMC2_DP0_C2M_P, FMC2_DP0_M2C_N, FMC2_DP0_M2C_P, FMC2_DP1_C2M_N, FMC2_DP1_C2M_P, FMC2_DP1_M2C_N, FMC2_DP1_M2C_P, FMC2_DP2_C2M_N, FMC2_DP2_C2M_P, FMC2_DP2_M2C_N, FMC2_DP2_M2C_P, FMC2_DP3_C2M_N, FMC2_DP3_C2M_P, FMC2_DP3_M2C_N, FMC2_DP3_M2C_P, FMC2_GBTCLK0_M2C_N, FMC2_GBTCLK0_M2C_P, FMC2_GBTCLK1_M2C_N, FMC2_GBTCLK1_M2C_P
net class DP1: FMC1_DP0_C2M_N, FMC1_DP0_C2M_P, FMC1_DP0_M2C_N, FMC1_DP0_M2C_P, FMC1_DP1_C2M_N, FMC1_DP1_C2M_P, FMC1_DP1_M2C_N, FMC1_DP1_M2C_P, FMC1_DP2_C2M_N, FMC1_DP2_C2M_P, FMC1_DP2_M2C_N, FMC1_DP2_M2C_P, FMC1_DP3_C2M_N, FMC1_DP3_C2M_P, FMC1_DP3_M2C_N, FMC1_DP3_M2C_P, FMC1_GBTCLK0_M2C_N, FMC1_GBTCLK0_M2C_P, FMC1_GBTCLK1_M2C_N, FMC1_GBTCLK1_M2C_P
net class MGT_CLKS: FMC2_GBTCLK1_M2C_N, FMC2_GBTCLK1_M2C_P, FP2_CLK1_C_N, FP2_CLK1_C_P, LINK01_CLK_N, LINK01_CLK_P, MGT113_CLK0_N, MGT113_CLK0_P, MGT113_CLK1_N, MGT113_CLK1_P, MGT213_CLK1_N, MGT213_CLK1_P, MGT216_CLK0_N, MGT216_CLK0_P, PCIE_CLK1_C_N, PCIE_CLK1_C_P, PCIE_CLK2_C_N, PCIE_CLK2_C_P
net class SE60DE100: FMC1_DP0_C2M_N, FMC1_DP0_C2M_P, FMC1_DP0_M2C_N, FMC1_DP0_M2C_P, FMC1_DP1_C2M_N, FMC1_DP1_C2M_P, FMC1_DP1_M2C_N, FMC1_DP1_M2C_P, FMC1_DP2_C2M_N, FMC1_DP2_C2M_P, FMC1_DP2_M2C_N, FMC1_DP2_M2C_P, FMC1_DP3_C2M_N, FMC1_DP3_C2M_P, FMC1_DP3_M2C_N, FMC1_DP3_M2C_P, FMC1_GBTCLK0_M2C_N, FMC1_GBTCLK0_M2C_P, FMC1_GBTCLK1_M2C_N, FMC1_GBTCLK1_M2C_P, FMC2_DP0_C2M_N, FMC2_DP0_C2M_P, FMC2_DP0_M2C_N, FMC2_DP0_M2C_P, FMC2_DP1_C2M_N, FMC2_DP1_C2M_P, FMC2_DP1_M2C_N, FMC2_DP1_M2C_P, FMC2_DP2_C2M_N, FMC2_DP2_C2M_P, FMC2_DP2_M2C_N, FMC2_DP2_M2C_P, FMC2_DP3_C2M_N, FMC2_DP3_C2M_P, FMC2_DP3_M2C_N, FMC2_DP3_M2C_P, FMC2_GBTCLK0_M2C_N, FMC2_GBTCLK0_M2C_P, FMC2_GBTCLK1_M2C_N, FMC2_GBTCLK1_M2C_P, FP2_CLK1_C_N, FP2_CLK1_C_P, LINK01_CLK_N, LINK01_CLK_P, LINK23_CLK_N, LINK23_CLK_P, MGT113_CLK0_N, MGT113_CLK0_P, MGT113_CLK1_N, MGT113_CLK1_P, MGT116_CLK0_N, MGT116_CLK0_P, MGT116_CLK1_N, MGT116_CLK1_P, MGT213_CLK0_N, MGT213_CLK0_P, MGT213_CLK1_N, MGT213_CLK1_P, MGT216_CLK0_N, MGT216_CLK0_P, PCIE_CLK1_C_N, PCIE_CLK1_C_P, PCIE_CLK2_C_N, PCIE_CLK2_C_P, RTM_FPGA_CLK1_N, RTM_FPGA_CLK1_P, RTM_FPGA_CLK2_N, RTM_FPGA_CLK2_P, Rx0_N, Rx0_P, Rx1_N, Rx1_P, Rx2C_N, Rx2C_P, Rx3C_N, Rx3C_P, Rx4_N, Rx4_P, Rx5_N, Rx5_P, Rx6_N, Rx6_P, Rx7_N, Rx7_P, Rx8_N, Rx8_P, Rx9_N, Rx9_P, Rx10_N, Rx10_P, Rx11_N, Rx11_P, Rx12_N, Rx12_P, Rx13_N, Rx13_P, Rx14_N, Rx14_P, Rx15_N, Rx15_P, Rx113_0_N, Rx113_0_P, Rx113_1_N, Rx113_1_P, Rx113_2_N, Rx113_2_P, Rx113_3_N, Rx113_3_P, Rx116_0_N, Rx116_0_P, Rx116_1_N, Rx116_1_P, Rx116_2_N, Rx116_2_P, Rx116_3_N, Rx116_3_P, Rx213_0_N, Rx213_0_P, Rx213_1_N, Rx213_1_P, Rx213_2_N, Rx213_2_P, Rx213_3_N, Rx213_3_P, Rx216_0_N, Rx216_0_P, Rx216_1_N, Rx216_1_P, Rx216_2_N, Rx216_2_P, Rx216_3_N, Rx216_3_P, RxC0_N, RxC0_P, SFP1RX_N, SFP1RX_P, SFP1TX_N, SFP1TX_P, SFP2RX_N, SFP2RX_P, SFP2TX_N, SFP2TX_P, SFP3RX_N, SFP3RX_P, SFP3TX_N, SFP3TX_P, SFP4RX_N, SFP4RX_P, SFP4TX_N, SFP4TX_P, SFP5RX_N, SFP5RX_P, SFP5TX_N, SFP5TX_P, SFP6RX_N, SFP6RX_P, SFP6TX_N, SFP6TX_P, SFP7RX_N, SFP7RX_P, SFP7TX_N, SFP7TX_P, SFP8RX_N, SFP8RX_P, SFP8TX_N, SFP8TX_P, Tx0_N, Tx0_P, Tx1_N, Tx1_P, Tx2C_N, Tx2C_P, Tx3C_N, Tx3C_P, Tx4_N, Tx4_P, Tx5_N, Tx5_P, Tx6_N, Tx6_P, Tx7_N, Tx7_P, Tx8_N, Tx8_P, Tx9_N, Tx9_P, Tx10_N, Tx10_P, Tx11_N, Tx11_P, Tx12_N, Tx12_P, Tx13_N, Tx13_P, Tx14_N, Tx14_P, Tx15_N, Tx15_P, Tx113_0_N, Tx113_0_P, Tx113_1_N, Tx113_1_P, Tx113_2_N, Tx113_2_P, Tx113_3_N, Tx113_3_P, Tx116_0_N, Tx116_0_P, Tx116_1_N, Tx116_1_P, Tx116_2_N, Tx116_2_P, Tx116_3_N, Tx116_3_P, Tx213_0_N, Tx213_0_P, Tx213_1_N, Tx213_1_P, Tx213_2_N, Tx213_2_P, Tx213_3_N, Tx213_3_P, Tx216_0_N, Tx216_0_P, Tx216_1_N, Tx216_1_P, Tx216_2_N, Tx216_2_P, Tx216_3_N, Tx216_3_P, TxC0_N, TxC0_P
net class DE_SIG: FMC1_DP0_C2M_N, FMC1_DP0_C2M_P, FMC1_DP0_M2C_N, FMC1_DP0_M2C_P, FMC1_DP1_C2M_N, FMC1_DP1_C2M_P, FMC1_DP1_M2C_N, FMC1_DP1_M2C_P, FMC1_DP2_C2M_N, FMC1_DP2_C2M_P, FMC1_DP2_M2C_N, FMC1_DP2_M2C_P, FMC1_DP3_C2M_N, FMC1_DP3_C2M_P, FMC1_DP3_M2C_N, FMC1_DP3_M2C_P, FMC1_GBTCLK0_M2C_N, FMC1_GBTCLK0_M2C_P, FMC1_GBTCLK1_M2C_N, FMC1_GBTCLK1_M2C_P, FMC2_DP0_C2M_N, FMC2_DP0_C2M_P, FMC2_DP0_M2C_N, FMC2_DP0_M2C_P, FMC2_DP1_C2M_N, FMC2_DP1_C2M_P, FMC2_DP1_M2C_N, FMC2_DP1_M2C_P, FMC2_DP2_C2M_N, FMC2_DP2_C2M_P, FMC2_DP2_M2C_N, FMC2_DP2_M2C_P, FMC2_DP3_C2M_N, FMC2_DP3_C2M_P, FMC2_DP3_M2C_N, FMC2_DP3_M2C_P, FMC2_GBTCLK0_M2C_N, FMC2_GBTCLK0_M2C_P, FMC2_GBTCLK1_M2C_N, FMC2_GBTCLK1_M2C_P, FP2_CLK1_C_N, FP2_CLK1_C_P, LINK01_CLK_N, LINK01_CLK_P, LINK23_CLK_N, LINK23_CLK_P, MGT113_CLK0_N, MGT113_CLK0_P, MGT113_CLK1_N, MGT113_CLK1_P, MGT116_CLK0_N, MGT116_CLK0_P, MGT116_CLK1_N, MGT116_CLK1_P, MGT213_CLK0_N, MGT213_CLK0_P, MGT213_CLK1_N, MGT213_CLK1_P, MGT216_CLK0_N, MGT216_CLK0_P, PCIE_CLK1_C_N, PCIE_CLK1_C_P, PCIE_CLK2_C_N, PCIE_CLK2_C_P, RTM_FPGA_CLK1_N, RTM_FPGA_CLK1_P, RTM_FPGA_CLK2_N, RTM_FPGA_CLK2_P, Rx0_N, Rx0_P, Rx1_N, Rx1_P, Rx2C_N, Rx2C_P, Rx3C_N, Rx3C_P, Rx4_N, Rx4_P, Rx5_N, Rx5_P, Rx6_N, Rx6_P, Rx7_N, Rx7_P, Rx8_N, Rx8_P, Rx9_N, Rx9_P, Rx10_N, Rx10_P, Rx11_N, Rx11_P, Rx12_N, Rx12_P, Rx13_N, Rx13_P, Rx14_N, Rx14_P, Rx15_N, Rx15_P, Rx113_0_N, Rx113_0_P, Rx113_1_N, Rx113_1_P, Rx113_2_N, Rx113_2_P, Rx113_3_N, Rx113_3_P, Rx116_0_N, Rx116_0_P, Rx116_1_N, Rx116_1_P, Rx116_2_N, Rx116_2_P, Rx116_3_N, Rx116_3_P, Rx213_0_N, Rx213_0_P, Rx213_1_N, Rx213_1_P, Rx213_2_N, Rx213_2_P, Rx213_3_N, Rx213_3_P, Rx216_0_N, Rx216_0_P, Rx216_1_N, Rx216_1_P, Rx216_2_N, Rx216_2_P, Rx216_3_N, Rx216_3_P, RxC0_N, RxC0_P, SFP1RX_N, SFP1RX_P, SFP1TX_N, SFP1TX_P, SFP2RX_N, SFP2RX_P, SFP2TX_N, SFP2TX_P, SFP3RX_N, SFP3RX_P, SFP3TX_N, SFP3TX_P, SFP4RX_N, SFP4RX_P, SFP4TX_N, SFP4TX_P, SFP5RX_N, SFP5RX_P, SFP5TX_N, SFP5TX_P, SFP6RX_N, SFP6RX_P, SFP6TX_N, SFP6TX_P, SFP7RX_N, SFP7RX_P, SFP7TX_N, SFP7TX_P, SFP8RX_N, SFP8RX_P, SFP8TX_N, SFP8TX_P, Tx0_N, Tx0_P, Tx1_N, Tx1_P, Tx2C_N, Tx2C_P, Tx3C_N, Tx3C_P, Tx4_N, Tx4_P, Tx5_N, Tx5_P, Tx6_N, Tx6_P, Tx7_N, Tx7_P, Tx8_N, Tx8_P, Tx9_N, Tx9_P, Tx10_N, Tx10_P, Tx11_N, Tx11_P, Tx12_N, Tx12_P, Tx13_N, Tx13_P, Tx14_N, Tx14_P, Tx15_N, Tx15_P, Tx113_0_N, Tx113_0_P, Tx113_1_N, Tx113_1_P, Tx113_2_N, Tx113_2_P, Tx113_3_N, Tx113_3_P, Tx116_0_N, Tx116_0_P, Tx116_1_N, Tx116_1_P, Tx116_2_N, Tx116_2_P, Tx116_3_N, Tx116_3_P, Tx213_0_N, Tx213_0_P, Tx213_1_N, Tx213_1_P, Tx213_2_N, Tx213_2_P, Tx213_3_N, Tx213_3_P, Tx216_0_N, Tx216_0_P, Tx216_1_N, Tx216_1_P, Tx216_2_N, Tx216_2_P, Tx216_3_N, Tx216_3_P, TxC0_N, TxC0_P

## Notes on the sheet
- RX- SFP outputs
- TX - SFP inputs
- PCIE - Fat pipe 2
- OPTIONAL RTM SFP ROUTING TO THE MGT
- 4-9
  UNCONNECTED TO FPGA
- PCIE
- OPTIONAL P2/P3 PORTS ROUTING TO THE MGT
- Project/Equipment
- Document
- Designer
- Drawn by
- Check.by
- Last Mod.
- Copyright WUT ISE 2020
  This documentation describes Open Hardware and is licensed under CERN OHL v.1.1. You may redistribute and modify this documentaction under the terms of the CERN OHL v1.1.
  (http://ohwr.org/CERNOHL). This documentation is dristributed WITHOUT ANY EXPRESS OR IMPLIED WARRANTY, INCLUDING OF MERCHANTABLITY, SATISFACTORY QUALITY AND FITNESS FOR A PARTICULAR PURPOSE. Please see the CERN OHL v.1.1 for applicable conditions
- Contact:
- File
- Print Date
- Sheet
- Size
- A2
- of
- Rev
- (in symbol R0402_100R_1%_0.0625W_100PPM) 1%

## Library data of the parts
C178-C207 C318-C333 C626-C633 C822-C837 C840 C841 C883-C886 = CC0201_100NF_6.3V_10%_X5R: Non-polarised capacitor; Part Description: SMD Multilayer Chip Ceramic Capacitor; Manufacturer: GENERIC; Manufacturer1 Part Number: 02016D104KAT2A; Value: 100nF; Voltage: 6.3V; TC: X5R; Tolerance: ±10%; Table: Capacitors SMD; Part Number: CC0201_100NF_6.3V_10%_X5R; Component Kind: Standard; Component Type: Standard; Pin Count: 2; Status: Not Recommended; Manufacturer Part Number: CC0201_100NF_6.3V_10%_X5R; Case: 0201; Mounted: Yes; Socket: No; SMD: Yes; Manufacturer1 Example: AVX; Manufacturer1 ComponentHeight: 0.33mm; HelpURL: \\cern.ch\dfs\Applications\Altium\Datasheets\CC0201_X5R_AVX.pdf; Author: CERN DEM JLC; CreateDate: 2007-12-03; LatestRevisionDate: 2007-12-03
C219-C225 C227 C228 C334-C349 C402 C409 C411 C413 C455 C461 C463 C512 C514 C575 C590 C625 C751-C753 C777-C812 C838 C839 = CC0201_100NF_6.3V_10%_X5R: Non-polarised capacitor; Part Description: SMD Multilayer Chip Ceramic Capacitor; Manufacturer: GENERIC; Manufacturer1 Part Number: 02016D104KAT2A; Voltage: 6.3V; TC: X5R; Tolerance: ±10%; Table: Capacitors SMD; Part Number: CC0201_100NF_6.3V_10%_X5R; Component Kind: Standard; Component Type: Standard; Pin Count: 2; Value: 100nF; Status: Not Recommended; Manufacturer Part Number: CC0201_100NF_6.3V_10%_X5R; Case: 0201; Mounted: Yes; Socket: No; SMD: Yes; Manufacturer1 Example: AVX; Manufacturer1 ComponentHeight: 0.33mm; HelpURL: \\cern.ch\dfs\Applications\Altium\Datasheets\CC0201_X5R_AVX.pdf; Author: CERN DEM JLC; CreateDate: 2007-12-03; LatestRevisionDate: 2007-12-03
IC2 = XC7A200T-3FFG1156C: Artix-6 FPGA, 16 GTPs, 600 User I/Os, 1156-Pin BGA, Speed Grade 2, Commercial Grade, Pb-Free; Part Description: Artix-7 FPGA, 16 GTPs, 600 User I/Os, 1156-Pin BGA, Speed Grade 2, Commercial Grade, Pb-Free; Manufacturer: XILINX; Table: Logic; Part Number: XC7A200T-3FFG1156C; Component Kind: Standard; Component Type: Standard; Device: XC7A200T-3FFG1156C; PackageDescription: BGA, 1.00mm Pitch, Square; 1156 Pin, 34 Columns X 34 Rows, 35.00mm X 35.00mm X 3.350mm H; Manufacturer Part Number: XC7A200T-3FFG1156C; Pin Count: 1156; Case: BGA1156; Mounted: Yes; Socket: No; SMD: Yes; ComponentHeight: 3.35mm; HelpURL: \\cern.ch\dfs\Applications\Altium\Datasheets\XC7A350T-2FFG1156C.pdf; ComponentLink1URL: \\cern.ch\dfs\Applications\Altium\Datasheets\XC7A350T-2FFG1156C.pdf; ComponentLink1Description: Package/Pinout; Author: CERN DEM JLC; CreateDate: 2012-09-19; LatestRevisionDate: 2012-09-19
J18-J21 = HIROSE_U.FL-R-SMT-1(10): Part Description: Up to 6GHz Ultra Small Surface Mount Male Coaxial Connectors U.FL Series; Manufacturer: HIROSE (HRS); PressFit: No; Part Number: HIROSE_U.FL-R-SMT-1(10); Component Kind: Standard; Component Type: Standard; Pin Count: 2; Family: U.FL; Mounted: Yes; Socket: No; SMD: Yes; Sense: No; Status: None; Manufacturer Part Number: U.FL-R-SMT-1(10); ComponentHeight: 1.25mm; HelpURL: \\cern.ch\dfs\Applications\Altium\Datasheets\HIROSE_U.FL-R-SMT-1(10).pdf; Author: CERN DEM JLC; CreateDate: 24.03.2010; LatestRevisionDate: 24.03.2010
R142 R239 = R0402_100R_1%_0.0625W_100PPM: Resistor - 1%; Part Description: General Purpose Thick Film Chip Resistor; Manufacturer: GENERIC; Manufacturer1 Part Number: 232270671001L; TC: ±100ppm/°C; Table: Resistors SMD; Part Number: R0402_100R_1%_0.0625W_100PPM; Component Kind: Standard; Component Type: Standard; Pin Count: 2; Value: 100; Status: Not recommended; Power: 0.0625W; Tolerance: ±1%; Manufacturer Part Number: R0402_100R_1%_0.0625W_100PPM; Case: 0402; Mounted: Yes; Socket: No; SMD: Yes; Manufacturer1 Example: YAGEO PHYCOMP; Manufacturer1 ComponentHeight: 0.4mm; HelpURL: \\cern.ch\dfs\Applications\Altium\Datasheets\R0402_Phycomp_RC0402.pdf; Author: CERN DEM JLC; CreateDate: 2007-12-03; LatestRevisionDate: 2012-10-17